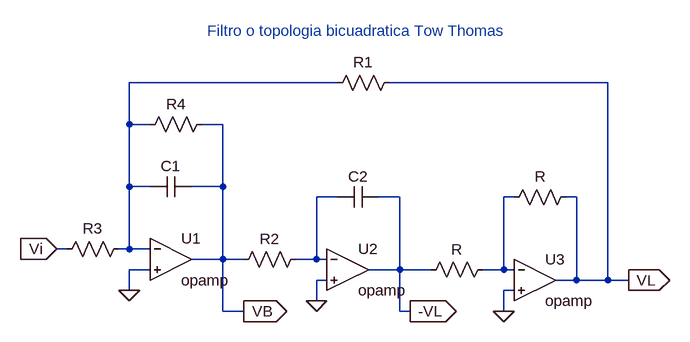
[diagram p0: schematic TowThomasCircuito.asc]
TowThomasCircuito.asc, the LTspice schematic file:
Version 4
SHEET 1 880 680
WIRE 272 -160 -48 -160
WIRE 688 -160 352 -160
WIRE -48 -96 -48 -160
WIRE -16 -96 -48 -96
WIRE 96 -96 64 -96
WIRE -48 0 -48 -96
WIRE -16 0 -48 0
WIRE 96 0 96 -96
WIRE 96 0 48 0
WIRE 272 16 240 16
WIRE 368 16 336 16
WIRE 544 16 528 16
WIRE 640 16 624 16
WIRE -144 96 -160 96
WIRE -48 96 -48 0
WIRE -48 96 -64 96
WIRE -16 96 -48 96
WIRE 96 112 96 0
WIRE 96 112 48 112
WIRE 128 112 96 112
WIRE 240 112 240 16
WIRE 240 112 208 112
WIRE 256 112 240 112
WIRE -16 128 -48 128
WIRE 368 128 368 16
WIRE 368 128 320 128
WIRE 416 128 368 128
WIRE 528 128 528 16
WIRE 528 128 496 128
WIRE 544 128 528 128
WIRE 256 144 240 144
WIRE 640 144 640 16
WIRE 640 144 608 144
WIRE 688 144 688 -160
WIRE 688 144 640 144
WIRE 720 144 688 144
WIRE -48 160 -48 128
WIRE 544 160 528 160
WIRE 240 176 240 144
WIRE 96 192 96 112
WIRE 128 192 96 192
WIRE 368 192 368 128
WIRE 384 192 368 192
WIRE 528 192 528 160
FLAG -48 160 0
FLAG 240 176 0
FLAG 528 192 0
FLAG 128 192 VB
IOPIN 128 192 Out
FLAG 384 192 -VL
IOPIN 384 192 Out
FLAG 720 144 VL
IOPIN 720 144 Out
FLAG -160 96 Vi
IOPIN -160 96 In
SYMBOL OpAmps\\opamp 16 48 R0
SYMATTR InstName U1
SYMBOL OpAmps\\opamp 288 64 R0
SYMATTR InstName U2
SYMBOL OpAmps\\opamp 576 80 R0
SYMATTR InstName U3
SYMBOL res -48 80 R90
WINDOW 0 0 56 VBottom 2
WINDOW 3 32 56 VTop 2
SYMATTR InstName R3
SYMATTR Value ""
SYMBOL res 80 -112 R90
WINDOW 0 0 56 VBottom 2
WINDOW 3 32 56 VTop 2
SYMATTR InstName R4
SYMATTR Value ""
SYMBOL cap 48 -16 R90
WINDOW 0 0 32 VBottom 2
WINDOW 3 32 32 VTop 2
SYMATTR InstName C1
SYMATTR Value ""
SYMBOL res 224 96 R90
WINDOW 0 0 56 VBottom 2
WINDOW 3 32 56 VTop 2
SYMATTR InstName R2
SYMATTR Value ""
SYMBOL cap 336 0 R90
WINDOW 0 0 32 VBottom 2
WINDOW 3 32 32 VTop 2
SYMATTR InstName C2
SYMATTR Value ""
SYMBOL res 512 112 R90
WINDOW 0 0 56 VBottom 2
WINDOW 3 32 56 VTop 2
SYMATTR InstName R
SYMATTR Value ""
SYMBOL res 640 0 R90
WINDOW 0 0 56 VBottom 2
WINDOW 3 32 56 VTop 2
SYMATTR InstName R
SYMATTR Value ""
SYMBOL res 368 -176 R90
WINDOW 0 0 56 VBottom 2
WINDOW 3 32 56 VTop 2
SYMATTR InstName R1
SYMATTR Value ""
TEXT 72 -240 Left 2 ;Filtro o topologia bicuadratica Tow Thomas

The netlist it stands for:
* TowThomasCircuito.asc
XU1 N001 0 VB opamp Aol=100K GBW=10Meg  ; pins invin noninvin out
XU2 N002 0 -VL opamp Aol=100K GBW=10Meg  ; pins invin noninvin out
XU3 N003 0 VL opamp Aol=100K GBW=10Meg  ; pins invin noninvin out
R3 N001 Vi
R4 VB N001
C1 VB N001
R2 N002 VB
C2 -VL N002
R N003 -VL
R VL N003
R1 VL N001
* Filtro o topologia bicuadratica Tow Thomas
.backanno
.end